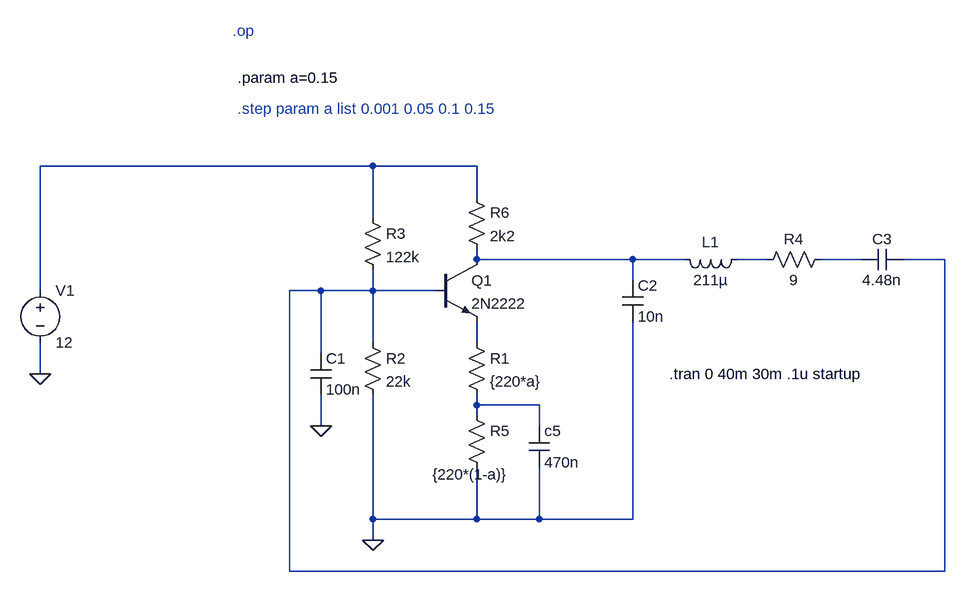
[diagram p0: schematic labosc4.asc]
labosc4.asc, the LTspice schematic file:
Version 4
SHEET 1 3972 680
WIRE 112 -16 -400 -16
WIRE 272 -16 112 -16
WIRE 272 32 272 -16
WIRE 112 64 112 -16
WIRE 272 128 272 112
WIRE 512 128 272 128
WIRE 592 128 512 128
WIRE 720 128 672 128
WIRE 864 128 800 128
WIRE 992 128 928 128
WIRE 512 160 512 128
WIRE -400 176 -400 -16
WIRE 32 176 -16 176
WIRE 112 176 112 144
WIRE 112 176 32 176
WIRE 208 176 112 176
WIRE 112 256 112 176
WIRE 272 256 272 224
WIRE 32 272 32 176
WIRE -400 304 -400 256
WIRE 272 352 272 336
WIRE 368 352 272 352
WIRE 272 368 272 352
WIRE 32 384 32 336
WIRE 368 384 368 352
WIRE 112 528 112 336
WIRE 272 528 272 448
WIRE 272 528 112 528
WIRE 368 528 368 448
WIRE 368 528 272 528
WIRE 512 528 512 224
WIRE 512 528 368 528
WIRE 112 560 112 528
WIRE -16 608 -16 176
WIRE 992 608 992 128
WIRE 992 608 -16 608
FLAG -400 304 0
FLAG 112 560 0
FLAG 32 384 0
SYMBOL npn 208 128 R0
SYMATTR InstName Q1
SYMATTR Value 2N2222
SYMBOL res 256 240 R0
SYMATTR InstName R1
SYMATTR Value {220*a}
SYMBOL res 96 240 R0
SYMATTR InstName R2
SYMATTR Value 22k
SYMBOL res 96 48 R0
SYMATTR InstName R3
SYMATTR Value 122k
SYMBOL voltage -400 160 R0
WINDOW 123 0 0 Left 0
WINDOW 39 0 0 Left 0
SYMATTR InstName V1
SYMATTR Value 12
SYMBOL cap 352 384 R0
SYMATTR InstName c5
SYMATTR Value 470n
SYMBOL res 256 16 R0
SYMATTR InstName R6
SYMATTR Value 2k2
SYMBOL cap 16 272 R0
SYMATTR InstName C1
SYMATTR Value 100n
SYMBOL cap 496 160 R0
SYMATTR InstName C2
SYMATTR Value 10n
SYMBOL ind 688 112 R90
WINDOW 0 5 56 VBottom 2
WINDOW 3 32 56 VTop 2
SYMATTR InstName L1
SYMATTR Value 211µ
SYMBOL res 816 112 R90
WINDOW 0 0 56 VBottom 2
WINDOW 3 32 56 VTop 2
SYMATTR InstName R4
SYMATTR Value 9
SYMBOL cap 928 112 R90
WINDOW 0 0 32 VBottom 2
WINDOW 3 32 32 VTop 2
SYMATTR InstName C3
SYMATTR Value 4.48n
SYMBOL res 256 352 R0
WINDOW 3 -52 107 Left 2
SYMATTR InstName R5
SYMATTR Value {220*(1-a)}
TEXT -104 -224 Left 2 ;.op
TEXT 568 304 Left 2 !.tran 0 40m 30m .1u startup
TEXT -96 -152 Left 2 !.param a=0.15
TEXT -96 -104 Left 2 ;.step param a list 0.001 0.05 0.1 0.15

The netlist it stands for:
* labosc4.asc
Q1 N002 N005 N006 0 2N2222
R1 N006 N007 {220*a}
R2 N005 0 22k
R3 N001 N005 122k
V1 N001 0 12
c5 N007 0 470n
R6 N001 N002 2k2
C1 N005 0 100n
C2 N002 0 10n
L1 N003 N002 211µ
R4 N004 N003 9
C3 N005 N004 4.48n
R5 N007 0 {220*(1-a)}
.model NPN NPN
.model PNP PNP
.lib standard.bjt
* .op
.tran 0 40m 30m .1u startup
.param a=0.15
* .step param a list 0.001 0.05 0.1 0.15
.backanno
.end